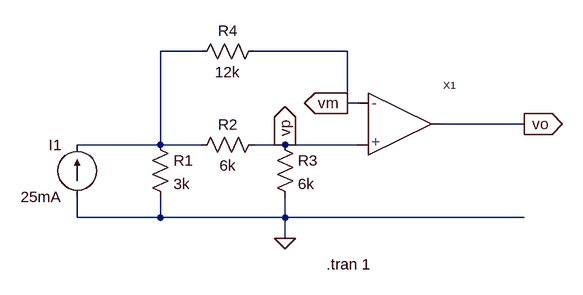
[diagram p0: schematic Draft3.asc]
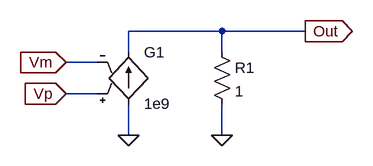
[diagram p1: sub-circuit op_amp.asc]
Draft3.asc, the LTspice schematic file:
Version 4
SHEET 1 880 680
WIRE -48 48 -112 48
WIRE 176 48 32 48
WIRE 176 128 176 48
WIRE 192 128 176 128
WIRE 448 160 320 160
WIRE -112 192 -112 48
WIRE -112 192 -240 192
WIRE -48 192 -112 192
WIRE 80 192 32 192
WIRE 192 192 80 192
WIRE -240 304 -240 272
WIRE -112 304 -112 272
WIRE -112 304 -240 304
WIRE 80 304 80 272
WIRE 80 304 -112 304
WIRE 448 304 80 304
WIRE 80 336 80 304
FLAG 80 336 0
FLAG 80 192 vp
IOPIN 80 192 Out
FLAG 176 128 vm
IOPIN 176 128 Out
FLAG 448 160 vo
IOPIN 448 160 Out
SYMBOL op_amp 208 160 R0
SYMATTR InstName X1
SYMBOL current -240 272 R180
WINDOW 0 24 80 Left 2
WINDOW 3 24 0 Left 2
WINDOW 123 0 0 Left 0
WINDOW 39 0 0 Left 0
SYMATTR InstName I1
SYMATTR Value 25mA
SYMBOL res -128 176 R0
SYMATTR InstName R1
SYMATTR Value 3k
SYMBOL res 48 176 R90
WINDOW 0 0 56 VBottom 2
WINDOW 3 32 56 VTop 2
SYMATTR InstName R2
SYMATTR Value 6k
SYMBOL res 64 176 R0
SYMATTR InstName R3
SYMATTR Value 6k
SYMBOL res 48 32 R90
WINDOW 0 0 56 VBottom 2
WINDOW 3 32 56 VTop 2
SYMATTR InstName R4
SYMATTR Value 12k
TEXT 144 376 Left 2 !.tran 1

op_amp.asc, the sub-circuit schematic file:
Version 4
SHEET 1 880 680
WIRE 304 176 160 176
WIRE 432 176 304 176
WIRE 160 208 160 176
WIRE 304 208 304 176
WIRE 112 224 64 224
WIRE 112 272 64 272
WIRE 160 336 160 288
WIRE 304 336 304 288
FLAG 160 336 0
FLAG 304 336 0
FLAG 64 224 Vm
IOPIN 64 224 In
FLAG 64 272 Vp
IOPIN 64 272 In
FLAG 432 176 Out
IOPIN 432 176 Out
SYMBOL g2 160 192 R0
SYMATTR InstName G1
SYMATTR Value 1e9
SYMBOL res 288 192 R0
SYMATTR InstName R1
SYMATTR Value 1

The netlist it stands for:
* Draft3.asc
XX1 vm vp vo op_amp
I1 0 N001 25mA
R1 N001 0 3k
R2 vp N001 6k
R3 vp 0 6k
R4 vm N001 12k

* block symbol definitions
.subckt op_amp Vm Vp Out
G1 0 Out Vp Vm 1e9
R1 Out 0 1
.ends op_amp

.tran 1
.backanno
.end